# Altium schematic sheet 0.SchDoc
size A4
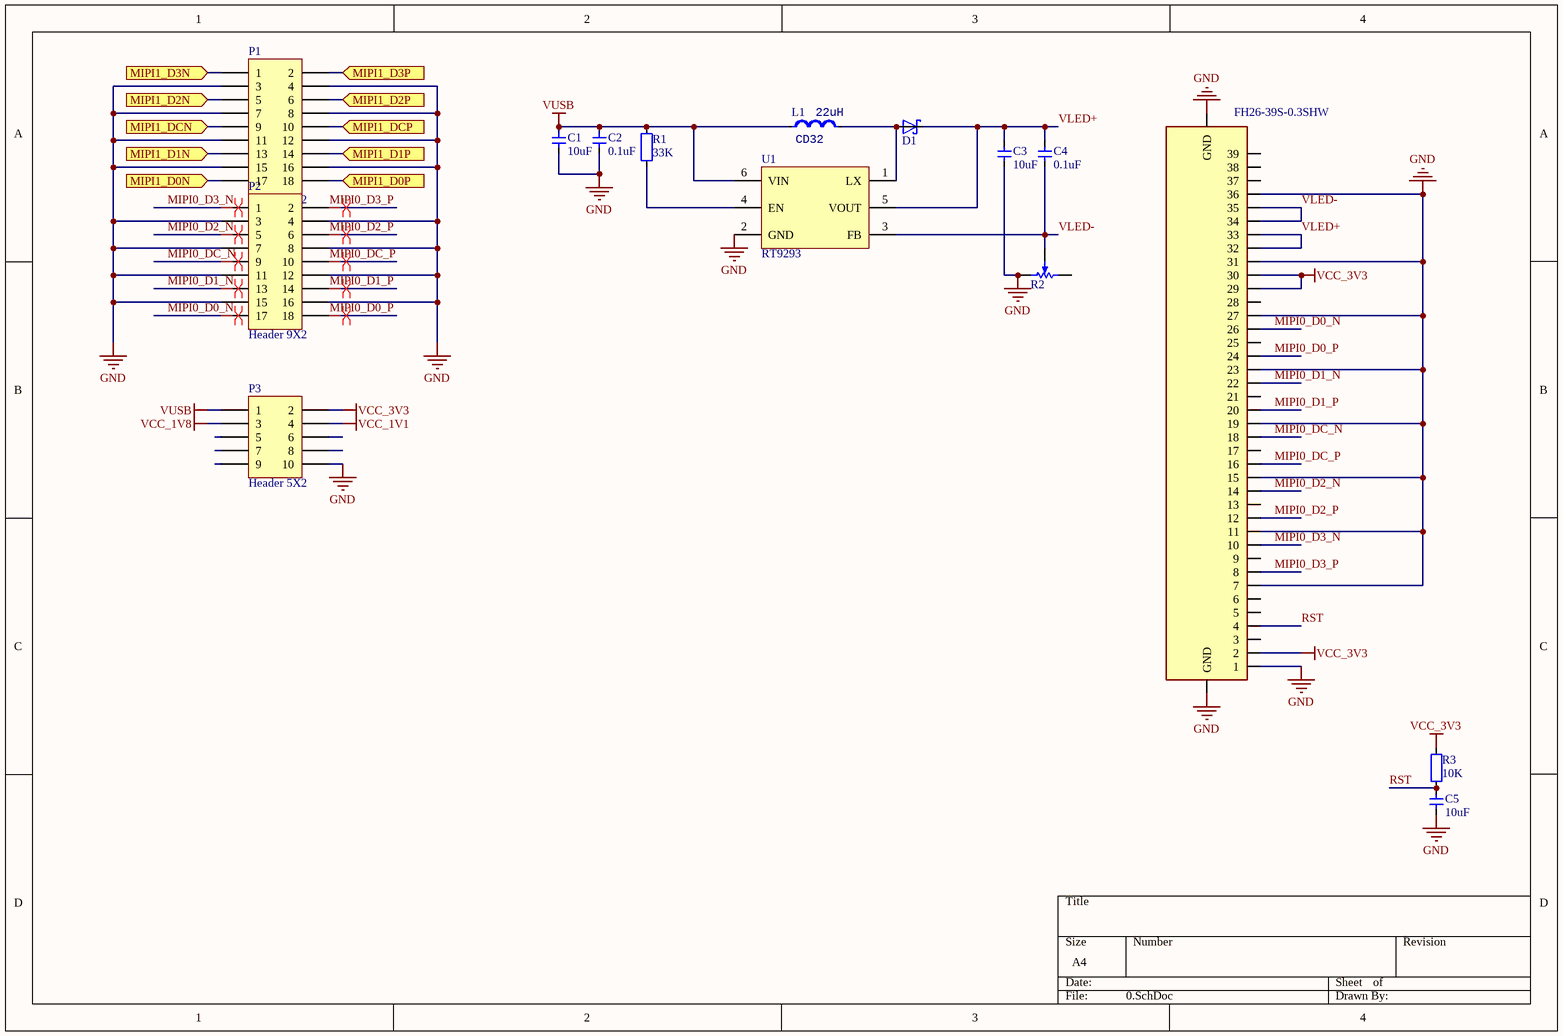
[diagram p0: 0.SchDoc]

## Parts
1  FH26-39S-0.3SHW  [FH26-39S-0.3SHW]
C1  10uF  [0603_CAP]
C2  0.1uF  [0603_CAP]
C3  10uF  [0603_CAP]
C4  0.1uF  [0603_CAP]
C5  10uF  [0603_CAP]
D1  RSX501L-20  [SOD-123F_L2.8-W1.8-LS3.7-RD]  (value not drawn)
L1  value 22uH  [IND_CD32]  (hidden comment: CD32)
P1  Header 9X2  [HDR2X9]
P2  Header 9X2  [HDR2X9]
P3  Header 5X2  [HDR2X5]
R1  33K  [0603_RES]
R2  电位器-贴片  [贴片电位器 3*3]  (value not drawn)
R3  10K  [0603_RES]
U1  RT9293  [SOT23-6]

## Ports
MIPI1_D0N (in), MIPI1_D0P (in), MIPI1_D1N (in), MIPI1_D1P (in), MIPI1_D2N (in), MIPI1_D2P (in), MIPI1_D3N (in), MIPI1_D3P (in), MIPI1_DCN (in), MIPI1_DCP (in)

## Nets
GND: 1.1 1.7 1.11 1.15 1.19 1.23 1.27 1.31 1.36 1.GND1(GND) 1.GND2(GND) C1.1 C2.1 C3.1 C5.1 P1.3 P1.4 P1.7 P1.8 P1.11 P1.12 P1.15 P1.16 P2.3 P2.4 P2.7 P2.8 P2.11 P2.12 P2.15 P2.16 P3.10 R2.1(+) U1.2(GND)
VCC_1V1: P3.4
VCC_1V8: P3.3
VCC_3V3: 1.2 1.29 1.30 P3.2 R3.2
VUSB: C1.2 C2.2 L1.1 P3.1 R1.2 U1.6(VIN)
MIPI0_D0_N: 1.26 P2.17
MIPI0_D0_P: 1.24 P2.18
MIPI0_D1_N: 1.22 P2.13
MIPI0_D1_P: 1.20 P2.14
MIPI0_D2_N: 1.14 P2.5
MIPI0_D2_P: 1.12 P2.6
MIPI0_D3_N: 1.10 P2.1
MIPI0_D3_P: 1.8 P2.2
MIPI0_DC_N: 1.18 P2.9
MIPI0_DC_P: 1.16 P2.10
MIPI1_D0N: P1.17 ; port MIPI1_D0N
MIPI1_D0P: P1.18 ; port MIPI1_D0P
MIPI1_D1N: P1.13 ; port MIPI1_D1N
MIPI1_D1P: P1.14 ; port MIPI1_D1P
MIPI1_D2N: P1.5 ; port MIPI1_D2N
MIPI1_D2P: P1.6 ; port MIPI1_D2P
MIPI1_D3N: P1.1 ; port MIPI1_D3N
MIPI1_D3P: P1.2 ; port MIPI1_D3P
MIPI1_DCN: P1.9 ; port MIPI1_DCN
MIPI1_DCP: P1.10 ; port MIPI1_DCP
RST: 1.4 C5.2 R3.1
VLED+: 1.32 1.33 C3.2 C4.2 D1.1 U1.5(VOUT)
VLED-: 1.34 1.35 C4.1 R2.3(W) U1.3(FB)
NetD1_2: D1.2 L1.2 U1.1(LX)
NetR1_1: R1.1 U1.4(EN)

Not connected (* = marked no-connect by the designer): 1 3 5 6 9 13 17 21 25 28 37 38 39; P3 5 6 7 8 9; R2 2(-)

## Layout directives
differential pair: MIPI0_D0_N, MIPI0_D0_P, MIPI0_D1_N, MIPI0_D1_P, MIPI0_D2_N, MIPI0_D2_P, MIPI0_D3_N, MIPI0_D3_P, MIPI0_DC_N, MIPI0_DC_P

## Library data of the parts
1 = FH26-39S-0.3SHW: 39 Position FPC Connector Contacts, Bottom 0.012 _0.30mm_ Surface Mount, Right Angle; MF: Hirose; Package: None; Value: *; Availability: Unavailable; MP: FH26-39S-0.3SHW; SnapEDA_Link: https://www.snapeda.com/parts/FH26-39S-0.3SHW/Hirose/view-part/44187/?ref=snap; Price: None
C1-C5 = 电容-0402: Capacitor; Value: 0.1u
D1 = RSX501L-20: Diode Schottky 40V 1A Surface Mount SMA _DO-214AC_; MP: SS14; MF: ON Semiconductor; Package: DO-214AC-214 ON Semiconductor; Value: *; Availability: Unavailable; Price: None; SnapEDA_Link: https://www.snapeda.com/parts/SS14/ON%20Semiconductor/view-part/1413348/?ref=snap
L1 = Ind_CD32: Inductor; Specification: ±5% 100mA; Manufacturer: *; Type: CD32
P1 P2 = Header 9X2: Header, 9-Pin, Dual row; LatestRevisionDate: 17-Jul-2002; LatestRevisionNote: Re-released for DXP Platform.; Publisher: Altium Limited
P3 = Header 5X2: Header, 5-Pin, Dual row; LatestRevisionDate: 17-Jul-2002; LatestRevisionNote: Re-released for DXP Platform.; Publisher: Altium Limited
R1 R3 = 电阻-0402: Resistor; Value: 22R
U1 = RT9293: LCD-LED Driver
R2 = 电位器-贴片: Published: 17-Dec-2003; DatasheetVersion: Oct-2003; PackageReference: POT4MM-2; Publisher: Altium Limited; PackageDescription: Square Trimming Potentiometer; ComponentLink1Description: Manufacturer Link; ComponentLink1URL: http://bourns.com/2/search.html